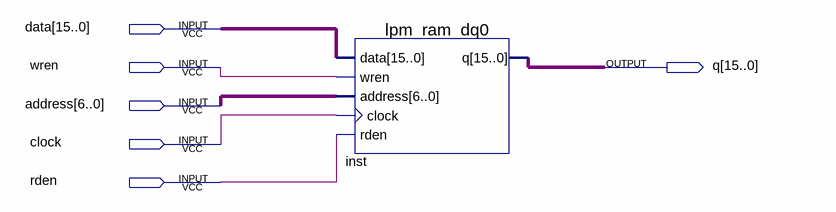
[diagram p0: schematic sheet]
// Quartus schematic lab10_2.bdf as structural Verilog: 1 symbols, 6 pins
module lab10_2 (
  input  [15:0] data,
  input  wren,
  input  [6:0] address,
  input  clock,
  input  rden,
  output [15:0] q
);

  lpm_ram_dq0 inst (.data(data), .wren(wren), .address(address), .clock(clock), .rden(rden), .q(q));
endmodule
